# Altium schematic sheet lps_display_rev_g_p1.SchDoc
size B; Revision: F; SheetNumber: 1; SheetTotal: 2
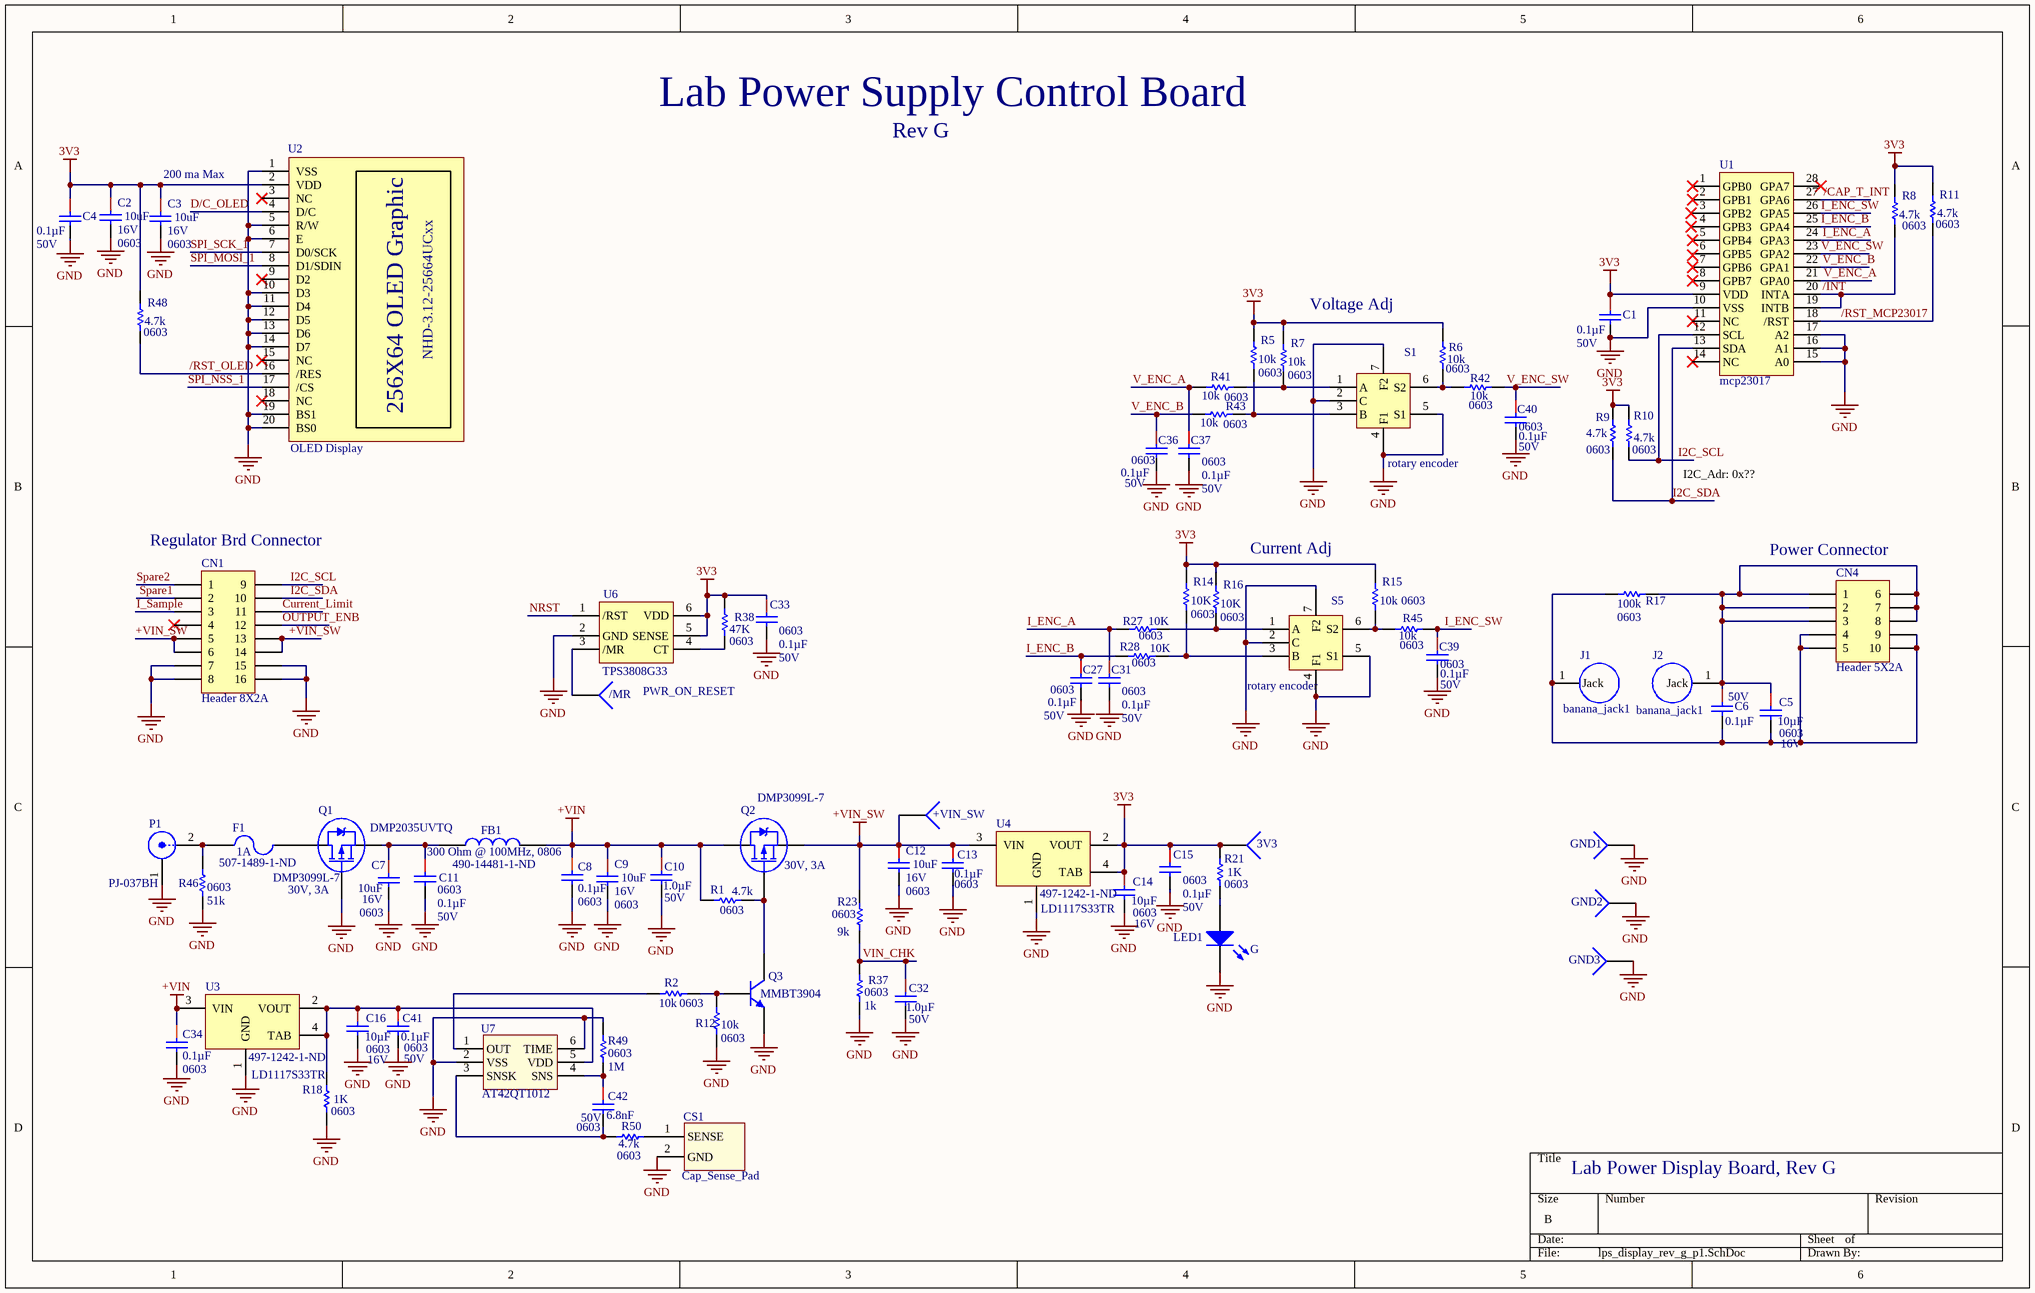
[diagram p0: lps_display_rev_g_p1.SchDoc]

## Parts
3V3  (no value)  [TestPoint-TH 35 mil]  (no BOM)
+VIN_SW  (no value)  [TestPoint-TH 35 mil]  (no BOM)
/MR  (no value)  [TestPoint-TH 35 mil]  (no BOM)
C1  Capacitance: 0.1µF  Voltage - Rated: 50V  [CAPC0603(1608)_N]  (hidden comment: 0.1uF 0603 50V)
C2  10uF  Package / Case: 0603  Voltage - Rated: 16V  [CAPC0603(1608)_N]
C3  10uF  Package / Case: 0603  Voltage - Rated: 16V  [CAPC0603(1608)_N]
C4  Capacitance: 0.1µF  Voltage - Rated: 50V  [CAPC0603(1608)_N]  (hidden comment: 0.1uF 0603 50V)
C5  Capacitance: 10µF  Package / Case: 0603  Voltage - Rated: 16V  [CAPC0603(1608)_N]  (hidden comment: 10uF)
C6  Capacitance: 0.1µF  Voltage - Rated: 50V  [CAPC0603(1608)_N]  (hidden comment: 0.1uF 0603 50V)
C7  10uF  Package / Case: 0603  Voltage - Rated: 16V  [CAPC0603(1608)_N]
C8  Capacitance: 0.1µF  Package / Case: 0603  [CAPC0603(1608)_N]  (hidden comment: 0.1uF)
C9  10uF  Package / Case: 0603  Voltage - Rated: 16V  [CAPC0603(1608)_N]
C10  Capacitance: 1.0µF  Voltage - Rated: 50V  [CAPC0603(1608)_N]  (hidden comment: 0.1uF 0603 50V)
C11  Package / Case: 0603  Capacitance: 0.1µF  Voltage - Rated: 50V  [CAPC0603(1608)_N]  (hidden comment: 0.1uF 0603 50V)
C12  10uF  Package / Case: 0603  Voltage - Rated: 16V  [CAPC0603(1608)_N]
C13  Package / Case: 0603  Capacitance: 0.1µF  [CAPC0603(1608)_N]  (hidden comment: 0.47uF)
C14  Capacitance: 10µF  Package / Case: 0603  Voltage - Rated: 16V  [CAPC0603(1608)_N]  (hidden comment: 10uF)
C15  Package / Case: 0603  Capacitance: 0.1µF  Voltage - Rated: 50V  [CAPC0603(1608)_N]  (hidden comment: 0.1uF 0603 50V)
C16  Capacitance: 10µF  Package / Case: 0603  Voltage - Rated: 16V  [CAPC0603(1608)_N]  (hidden comment: 10uF)
C27  Package / Case: 0603  Capacitance: 0.1µF  Voltage - Rated: 50V  [CAPC0603(1608)_N]  (hidden comment: 0.1uF 0603 50V)
C31  Package / Case: 0603  Capacitance: 0.1µF  Voltage - Rated: 50V  [CAPC0603(1608)_N]  (hidden comment: 0.1uF 0603 50V)
C32  Capacitance: 1.0µF  Voltage - Rated: 50V  [CAPC0603(1608)_N]  (hidden comment: 0.1uF 0603 50V)
C33  Package / Case: 0603  Capacitance: 0.1µF  Voltage - Rated: 50V  [CAPC0603(1608)_N]  (hidden comment: 0.1uF 0603 50V)
C34  Capacitance: 0.1µF  Package / Case: 0603  [CAPC0603(1608)_N]  (hidden comment: 0.1uF)
C36  Package / Case: 0603  Capacitance: 0.1µF  Voltage - Rated: 50V  [CAPC0603(1608)_N]  (hidden comment: 0.1uF 0603 50V)
C37  Package / Case: 0603  Capacitance: 0.1µF  Voltage - Rated: 50V  [CAPC0603(1608)_N]  (hidden comment: 0.1uF 0603 50V)
C39  Package / Case: 0603  Capacitance: 0.1µF  Voltage - Rated: 50V  [CAPC0603(1608)_N]  (hidden comment: 0.1uF 0603 50V)
C40  Package / Case: 0603  Capacitance: 0.1µF  Voltage - Rated: 50V  [CAPC0603(1608)_N]  (hidden comment: 0.1uF 0603 50V)
C41  Package / Case: 0603  Capacitance: 0.1µF  Voltage - Rated: 50V  [CAPC0603(1608)_N]  (hidden comment: 0.1uF 0603 50V)
C42  Package / Case: 0603  Capacitance: 6.8nF  Voltage - Rated: 50V  [CAPC0603(1608)_N]  (hidden comment: 0.1uF 0603 50V)
CN1  Header 8X2A  [HDR2X8_CEN]
CN4  Header 5X2A  [HDR2X5_CEN]
CS1  Cap_Sense_Pad  [CAP_TOUCH_ROUND]
F1  1A  [PTC-3225[1210]]
FB1  300 Ohm @ 100MHz, 0806  [RESC0805(2012)_M]
GND1  (no value)  [TestPoint-TH 35 mil]  (no BOM)
GND2  (no value)  [TestPoint-TH 35 mil]  (no BOM)
GND3  (no value)  [TestPoint-TH 35 mil]  (no BOM)
J1  banana_jack1  [Banana_jack1]
J2  banana_jack1  [Banana_jack1]
LED1  G  [SM-LED-0603]
P1  PJ-037BH  [pwrplug]
Q1  DMP3099L-7  Text: 30V, 3A  [SOT23]
Q2  DMP3099L-7  Text: 30V, 3A  [SOT23]
Q3  MMBT3904  [SOT23]
R1  Package / Case: 0603  [RESC0603(1608)_N]  (hidden comment: 4.7K)
R2  Resistance (Ohms): 10k  Package / Case: 0603  [RESC0603(1608)_N]  (hidden comment: 4.7K)
R5  Resistance (Ohms): 10k  Package / Case: 0603  [RESC0603(1608)_N]  (hidden comment: 4.7K)
R6  Resistance (Ohms): 10k  Package / Case: 0603  [RESC0603(1608)_N]  (hidden comment: 4.7K)
R7  Resistance (Ohms): 10k  Package / Case: 0603  [RESC0603(1608)_N]  (hidden comment: 4.7K)
R8  Package / Case: 0603  [RESC0603(1608)_N]  (hidden comment: 4.7K)
R9  Package / Case: 0603  [RESC0603(1608)_N]  (hidden comment: 4.7K)
R10  Package / Case: 0603  [RESC0603(1608)_N]  (hidden comment: 4.7K)
R11  Package / Case: 0603  [RESC0603(1608)_N]  (hidden comment: 4.7K)
R12  Resistance (Ohms): 10k  Package / Case: 0603  [RESC0603(1608)_N]  (hidden comment: 4.7K)
R14  Resistance (Ohms): 10K  Package / Case: 0603  [RESC0603(1608)_N]  (hidden comment: 4.7K)
R15  Resistance (Ohms): 10k  Package / Case: 0603  [RESC0603(1608)_N]  (hidden comment: 4.7K)
R16  Resistance (Ohms): 10K  Package / Case: 0603  [RESC0603(1608)_N]  (hidden comment: 4.7K)
R17  Resistance (Ohms): 100k  Package / Case: 0603  [RESC0603(1608)_N]  (hidden comment: 4.7K)
R18  Resistance (Ohms): 1K  Package / Case: 0603  [RESC0603(1608)_N]  (hidden comment: 4.7K)
R21  Resistance (Ohms): 1K  Package / Case: 0603  [RESC0603(1608)_N]  (hidden comment: 4.7K)
R23  Package / Case: 0603  Resistance (Ohms): 9k  [RESC0603(1608)_N]  (hidden comment: 1.0K)
R27  Resistance (Ohms): 10K  Package / Case: 0603  [RESC0603(1608)_N]  (hidden comment: 4.7K)
R28  Resistance (Ohms): 10K  Package / Case: 0603  [RESC0603(1608)_N]  (hidden comment: 4.7K)
R37  Package / Case: 0603  Resistance (Ohms): 1k  [RESC0603(1608)_N]  (hidden comment: 1.0K)
R38  Resistance (Ohms): 47K  Package / Case: 0603  [RESC0603(1608)_N]  (hidden comment: 4.7K)
R41  Resistance (Ohms): 10k  Package / Case: 0603  [RESC0603(1608)_N]  (hidden comment: 4.7K)
R42  Resistance (Ohms): 10k  Package / Case: 0603  [RESC0603(1608)_N]  (hidden comment: 4.7K)
R43  Resistance (Ohms): 10k  Package / Case: 0603  [RESC0603(1608)_N]  (hidden comment: 4.7K)
R45  Resistance (Ohms): 10k  Package / Case: 0603  [RESC0603(1608)_N]  (hidden comment: 4.7K)
R46  Package / Case: 0603  Resistance (Ohms): 51k  [RESC0603(1608)_N]  (hidden comment: 1.0K)
R48  Package / Case: 0603  [RESC0603(1608)_N]  (hidden comment: 4.7K)
R49  Package / Case: 0603  Resistance (Ohms): 1M  [RESC0603(1608)_N]  (hidden comment: 1.0K)
R50  Package / Case: 0603  Resistance (Ohms): 4.7k  [RESC0603(1608)_N]  (hidden comment: 1.0K)
S1  rotary encoder  [rotary encoder]
S5  rotary encoder  [rotary encoder]
U1  mcp23017  [SOIC28]
U2  OLED Display  [oled_graphic_256X64]
U3  Supplier Part Number 1: 497-1242-1-ND  [DSO-G3]  (hidden comment: 3.3V)
U4  Supplier Part Number 1: 497-1242-1-ND  [DSO-G3]  (hidden comment: 3.3V)
U6  TPS3808G33  [SOt-23-6]
U7  AT42QT1012  [SOt-23-6]

## Nets
3V3: 3V3.1 C1.1 C2.1 C3.1 C4.1 C14.1 C15.1 C33.1 R5.2 R6.2 R7.2 R8.2 R9.2 R10.2 R11.2 R14.2 R15.2 R16.2 R21.2 R38.2 R48.2 U1.9(VDD) U2.2(VDD) U4.2(VOUT) U4.4(TAB) U6.5(SENSE) U6.6(VDD)
+VIN: C8.1 C9.1 C10.1 C34.1 FB1.2 Q2.3(D) R1.2 U3.3(VIN)
+VIN_SW: +VIN_SW.1 C12.1 C13.1 CN1.5 CN1.6 CN1.13 CN1.14 Q2.2(S) R23.2 U4.3(VIN)
GND: C1.2 C2.2 C3.2 C4.2 C7.2 C8.2 C9.2 C10.2 C11.2 C12.2 C13.2 C14.2 C15.2 C16.2 C27.2 C31.2 C32.2 C33.2 C34.2 C36.2 C37.2 C39.2 C40.2 C41.2 CN1.7 CN1.8 CN1.15 CN1.16 CS1.2(GND) GND1.1 GND2.1 GND3.1 LED1.2 P1.1 Q1.1(G) Q3.2(E) R12.2 R18.1 R37.1 R46.1 R49.1 S1.2(C) S1.4(F1) S1.5(S1) S1.7(F2) S5.2(C) S5.4(F1) S5.5(S1) S5.7(F2) U1.10(VSS) U1.15(A0) U1.16(A1) U1.17(A2) U2.1(VSS) U2.5(R/W) U2.6(E) U2.10(D3) U2.11(D4) U2.12(D5) U2.13(D6) U2.14(D7) U2.19(BS1) U2.20(BS0) U3.1(GND) U4.1(GND) U6.2(GND) U7.2(VSS) U7.6(TIME)
/CAP_T_INT: U1.27(GPA6)
/INT: R8.1 U1.19(INTB) U1.20(INTA)
/RST_MCP23017: R11.1 U1.18(/RST)
/RST_OLED: R48.1 U2.16(/RES)
Current_Limit: CN1.11
D/C_OLED: U2.4(D/C)
I2C_SCL: CN1.9 R10.1 U1.12(SCL)
I2C_SDA: CN1.10 R9.1 U1.13(SDA)
I_ENC_A: C31.1 R27.2 U1.24(GPA3)
I_ENC_B: C27.1 R28.2 U1.25(GPA4)
I_ENC_SW: C39.1 R45.1 U1.26(GPA5)
I_Sample: CN1.3
NRST: U6.1(/RST)
OUTPUT_ENB: CN1.12
Spare1: CN1.2
Spare2: CN1.1
SPI_MOSI_1: U2.8(D1/SDIN)
SPI_NSS_1: U2.17(/CS)
SPI_SCK_1: U2.7(D0/SCK)
V_ENC_A: C37.1 R41.2 U1.21(GPA0)
V_ENC_B: C36.1 R43.2 U1.22(GPA1)
V_ENC_SW: C40.1 R42.1 U1.23(GPA2)
VIN_CHK: C32.1 R23.1 R37.2
Net/MR_1: /MR.1 U6.3(/MR)
NetC5_1: C5.1 C6.1 CN4.1 CN4.2 CN4.3 CN4.6 CN4.7 CN4.8 J2.1(Jack) R17.2
NetC5_2: C5.2 C6.2 CN4.4 CN4.5 CN4.9 CN4.10 J1.1(Jack) R17.1
NetC7_1: C7.1 C11.1 FB1.1 Q1.2(S)
NetC16_1: C16.1 C41.1 R18.2 U3.2(VOUT) U3.4(TAB) U7.5(VDD)
NetC42_1: C42.1 R49.2 U7.4(SNS)
NetC42_2: C42.2 R50.2 U7.3(SNSK)
NetCS1_1: CS1.1(SENSE) R50.1
NetF1_1: F1.1 P1.2 R46.2
NetF1_2: F1.2 Q1.3(D)
NetLED1_1: LED1.1 R21.1
NetQ2_1: Q2.1(G) Q3.3(C) R1.1
NetQ3_1: Q3.1(B) R2.1 R12.1
NetR2_2: R2.2 U7.1(OUT)
NetR5_1: R5.1 R43.1 S1.3(B)
NetR6_1: R6.1 R42.2 S1.6(S2)
NetR7_1: R7.1 R41.1 S1.1(A)
NetR14_1: R14.1 R28.1 S5.3(B)
NetR15_1: R15.1 R45.2 S5.6(S2)
NetR16_1: R16.1 R27.1 S5.1(A)
NetR38_1: R38.1 U6.4(CT)

Not connected (* = marked no-connect by the designer): CN1 4*; U1 1(GPB0)* 2(GPB1)* 3(GPB2) 4(GPB3) 5(GPB4)* 6(GPB5) 7(GPB6)* 8(GPB7)* 11(NC)* 14(NC)* 28(GPA7)*; U2 3(NC)* 9(D2)* 15(NC)* 18(NC)*

## Notes on the sheet
- Lab Power Supply Control Board
- Rev G
- (near C3) 200 ma Max
- Voltage Adj
- I2C_Adr: 0x??
- (near CN1) Regulator Brd Connector
- Current Adj
- (near CN4) Power Connector
- PWR_ON_RESET
- (near Q1) DMP2035UVTQ
- 507-1489-1-ND
- (near FB1) 490-14481-1-ND
- LD1117S33TR
- (near R18) LD1117S33TR
- Lab Power Display Board, Rev G
- (in symbol OLED Display) NHD-3.12-25664UCxx; 256X64 OLED Graphic

## Library data of the parts
3V3 +VIN_SW /MR GND1-GND3 = TestPoint: Test Point
C1 C4 C6 C10 C32 = CAP CER 0.1UF 50V 10% X7R 0603: Manufacturer: Kemet; Manufacturer Part Number: C0603C104K5RACTU; Tolerance: ±10%; Temperature Coefficient: X7R; ClassName: AD1; Supplier 1: Digi-Key; RoHS: RoHS Compliant; Category: Capacitors; Stock 1: 1397942; Pricing 1: 1=0.1, 10=0.041, 50=0.0222, 100=0.0187, 250=0.01532, 500=0.0131, 1000=0.0102 (USD); Packaging: Cut Tape (CT); Mounting Type: Surface Mount, MLCC; Operating Temperature: -55°C ~ 125°C; Applications: General Purpose; Ratings: -; Package / Case: 0603 (1608 Metric); Size / Dimension: 0.063" L x 0.031" W (1.60mm x 0.80mm); Height - Seated (Max): -; Thickness (Max): 0.034" (0.87mm); Lead Spacing: -; Features: -; Lead Style: -; ComponentLink1URL: http://www.kemet.com/docfinder?Partnumber=C0603C104K5RACTU; ComponentLink1Description: http://www.kemet.com/docfinder?Partnumber=C0603C104K5RACTU; Supplier Part Number 1: 399-5089-1-ND
C2 C3 C7 C9 C12 = CAP CER 10UF 16V 20% X5R 0603: 10UF 0603 16V; Manufacturer: Murata Electronics North America; Manufacturer Part Number: GRM188R61C106MA73D; Capacitance: 10µF; Tolerance: ±20%; Temperature Coefficient: X5R; Supplier 1: Digi-Key; RoHS: RoHS Compliant; Category: Capacitors; Stock 1: 99081; Pricing 1: 1=0.18, 10=0.167, 25=0.1428, 50=0.1214, 100=0.1167, 250=0.1048, 500=0.10002, 1000=0.08335 (USD); Packaging: Cut Tape (CT); Mounting Type: Surface Mount, MLCC; Operating Temperature: -55°C ~ 85°C; Applications: General Purpose; Ratings: -; Size / Dimension: 0.063" L x 0.031" W (1.60mm x 0.80mm); Height - Seated (Max): -; Thickness (Max): 0.031" (0.80mm); Lead Spacing: -; Features: -; Lead Style: -; ComponentLink1URL: http://www.murata.com/~/media/webrenewal/support/library/catalog/products/capacitor/mlcc/c02e.ashx; ComponentLink1Description: http://www.murata.com/~/media/webrenewal/support/library/catalog/products/capacitor/mlcc/c02e.ashx; Supplier Part Number 1: 490-7201-1-ND
C5 C14 C16 = CAP CER 10UF 16V 20% X5R 0603: 10UF 0603 16V; Manufacturer: Murata Electronics North America; Manufacturer Part Number: GRM188R61C106MA73D; Tolerance: ±20%; Temperature Coefficient: X5R; Supplier 1: Digi-Key; RoHS: RoHS Compliant; Category: Capacitors; Stock 1: 99081; Pricing 1: 1=0.18, 10=0.167, 25=0.1428, 50=0.1214, 100=0.1167, 250=0.1048, 500=0.10002, 1000=0.08335 (USD); Packaging: Cut Tape (CT); Mounting Type: Surface Mount, MLCC; Operating Temperature: -55°C ~ 85°C; Applications: General Purpose; Ratings: -; Size / Dimension: 0.063" L x 0.031" W (1.60mm x 0.80mm); Height - Seated (Max): -; Thickness (Max): 0.031" (0.80mm); Lead Spacing: -; Features: -; Lead Style: -; ComponentLink1URL: http://www.murata.com/~/media/webrenewal/support/library/catalog/products/capacitor/mlcc/c02e.ashx; ComponentLink1Description: http://www.murata.com/~/media/webrenewal/support/library/catalog/products/capacitor/mlcc/c02e.ashx; Supplier Part Number 1: 490-7201-1-ND
C8 C34 = CAP CER 0.1UF 16V 10% X7R 0603: 0.1uF 0603 16V; Manufacturer: Kemet; Manufacturer Part Number: C0603C104K4RACTU; Tolerance: ±10%; Temperature Coefficient: X7R; Supplier 1: Digi-Key; RoHS: RoHS Compliant; Category: Capacitors; Stock 1: 2360000; Pricing 1: 4000=0.00414, 8000=0.00378, 12000=0.0036, 28000=0.00342, 100000=0.00248 (USD); Packaging: Tape & Reel (TR); Mounting Type: Surface Mount, MLCC; Operating Temperature: -55°C ~ 125°C; Applications: General Purpose; Ratings: -; Size / Dimension: 0.063" L x 0.031" W (1.60mm x 0.80mm); Height - Seated (Max): -; Thickness (Max): 0.034" (0.87mm); Lead Spacing: -; Features: -; Lead Style: -; ComponentLink1URL: http://www.kemet.com/datasheets&C0603C104K4RACTU; ComponentLink1Description: http://www.kemet.com/datasheets&C0603C104K4RACTU; Supplier Part Number 1: 399-1096-2-ND; Voltage - Rated: 16V
C11 C15 C27 C31 C33 C36 C37 C39-C42 = CAP CER 0.1UF 50V 10% X7R 0603: Manufacturer: Yageo; Manufacturer Part Number: CC0603ZRY5V9BB104; Tolerance: -20%, +80%; Temperature Coefficient: Y5V (F); ClassName: *; Supplier 1: Digi-Key; RoHS: RoHS Compliant; Category: Capacitors; Stock 1: 2192156; Pricing 1: 1=0.1, 10=0.019, 100=0.0087, 500=0.0062, 1000=0.00487 (USD); Packaging: Cut Tape (CT); Part Status: Active; Operating Temperature: -30°C ~ 85°C; Features: -; Ratings: -; Applications: General Purpose; Failure Rate: -; Mounting Type: Surface Mount, MLCC; Size / Dimension: 0.063" L x 0.031" W (1.60mm x 0.80mm); Height - Seated (Max): -; Thickness (Max): 0.035" (0.90mm); Lead Spacing: -; Lead Style: -; ComponentLink1URL: http://www.yageo.com/documents/recent/UPY-GPHC_Y5V_6.3V-to-50V_8.pdf; ComponentLink1Description: http://www.yageo.com/documents/recent/UPY-GPHC_Y5V_6.3V-to-50V_8.pdf; Supplier Part Number 1: 311-1343-1-ND
C13 = CAP CER 0.47UF 16V 10% X7R 0603: 0.47uF 0603 16V; Manufacturer: Kemet; Manufacturer Part Number: C0603C474K4RACTU; Tolerance: ±10%; Temperature Coefficient: X7R; Supplier 1: Digi-Key; RoHS: RoHS Compliant; Category: Capacitors; Stock 1: 84679; Pricing 1: 1=0.15, 10=0.1, 50=0.0576, 100=0.0475, 250=0.04, 500=0.0335, 1000=0.0275 (USD); Packaging: Cut Tape (CT); Voltage - Rated: 16V; Mounting Type: Surface Mount, MLCC; Operating Temperature: -55°C ~ 125°C; Applications: General Purpose; Ratings: -; Size / Dimension: 0.063" L x 0.031" W (1.60mm x 0.80mm); Height - Seated (Max): -; Thickness (Max): 0.034" (0.87mm); Lead Spacing: -; Features: -; Lead Style: -; ComponentLink1URL: http://www.kemet.com/docfinder?Partnumber=C0603C474K4RACTU; ComponentLink1Description: http://www.kemet.com/docfinder?Partnumber=C0603C474K4RACTU; Supplier Part Number 1: 399-4922-1-ND
CN1 = CMP-001-0325-01: Header, 8-Pin, Dual row; Signal Integrity: Connector; Publisher: Altium Limited; Designator: Header 8X2A; LatestRevisionNote: Re-released for DXP Platform.; Pin Count: 16; Component Name: Header 8X2A; LatestRevisionDate: 17-Jul-2002
CN4 = CMP-001-0310-01: Header, 5-Pin, Dual row; Signal Integrity: Connector; Designator: Header 5X2A; Component Name: Header 5X2A; LatestRevisionDate: 17-Jul-2002; LatestRevisionNote: Re-released for DXP Platform.; Pin Count: 10; Publisher: Altium Limited
F1 = 0ZCB0050FF2G: 1A PTC Fuse; Manufacturer: Bel Fuse; Vendor: Digikey; PN: 507-1489-1-ND; MPN: 0ZCB0050FF2G
FB1 = FERRITE 40 OHM 1.5A 0805: 40 OHM 0805 1.5A; Manufacturer: Laird-Signal Integrity Products; Manufacturer Part Number: MI0805K400R-10; DC Resistance (DCR): 50 mOhm Max; Filter Type: Differential Mode - Single; Impedance @ Frequency: 40 Ohm @ 100MHz; Creator: osman; Supplier 1: Digi-Key; RoHS: RoHS Compliant; Category: Filters; Stock 1: 112318; Pricing 1: 1=0.1, 10=0.077, 25=0.07, 50=0.0628, 100=0.0461, 250=0.03352, 500=0.03074, 1000=0.02654 (USD); Packaging: Cut Tape (CT); Current Rating: 1.5A; Package / Case: 0805 (2012 Metric); Mounting Type: Surface Mount; Height (Max): 0.043" (1.10mm); Size / Dimension: 0.079" L x 0.049" W (2.00mm x 1.25mm); ComponentLink1URL: http://staging.lairdtech.com/WorkArea/linkit.aspx?LinkIdentifier=id&ItemID=4949; ComponentLink1Description: http://staging.lairdtech.com/WorkArea/linkit.aspx?LinkIdentifier=id&ItemID=4949; Supplier Part Number 1: 240-2389-1-ND
LED1 = 0603 LED: 0603 SMD LED; PN: P11500CT-ND; Vendor: Digikey
P1 = PJ-037BH: 2.5x5.5mm Power Jack; Manufacturer: CUI Inc; Gender: Male; Plug/Mating Plug Diameter: 2.5mm ID, 5.5mm OD; Number of Positions/Contacts: 2 Conductors, 2 Contacts; Internal Switch(s): Does Not Contain Switch; Shielding: Unshielded; Voltage - Rated: 16VDC; Current Rating: 5A; Supplier 1: Digi-Key; Manufacturer Part Number: PJ-037BH; RoHS: RoHS Compliant; Category: Connectors, Interconnects; Stock 1: 179; Pricing 1: 1=1.11, 10=0.777, 100=0.5217, 500=0.4218, 1000=0.3774, 2500=0.2997 (USD); Connector Type: Jack; Mounting Type: Through Hole, Right Angle; Termination: Solder Eyelet(s); Features: -; Color: Black; Contact Material: Copper; Contact Material - Plating: Nickel; Housing Color: Black; Housing Material: Thermoplastic; Operating Temperature: -; ComponentLink1URL: http://www.cui.com/product/resource/digikeypdf/pj-037bh.pdf; ComponentLink1Description: http://www.cui.com/product/resource/digikeypdf/pj-037bh.pdf; Supplier Part Number 1: CP-037BH-ND
Q1 Q2 = DMP3099L-7: MOSFET P-CH 30V SOT23; Manufacturer: Diodes Incorporated; FET Type: P-Channel; Current - Continuous Drain (Id) @ 25°C: 3.8A (Ta); Drive Voltage (Max Rds On,  Min Rds On): 4.5V, 10V; Vgs(th) (Max) @ Id: 2.1V @ 250µA; Vgs (Max): ±20V; Power Dissipation (Max): 1.08W (Ta); Rds On (Max) @ Id, Vgs: 65 mOhm @ 3.8A, 10V; Supplier 1: Digi-Key; Manufacturer Part Number: DMP3099L-7; RoHS: RoHS Compliant; Category: Discrete Semiconductor Products; Stock 1: 138833; Pricing 1: 1=0.42, 10=0.306, 100=0.1801, 500=0.10198, 1000=0.07818 (USD); Packaging: Cut Tape (CT); Part Status: Active; Technology: MOSFET (Metal Oxide); FET Feature: -; Operating Temperature: -55°C ~ 150°C (TJ); Mounting Type: Surface Mount; Supplier Device Package: SOT-23; Package / Case: TO-236-3, SC-59, SOT-23-3; ComponentLink1URL: https://www.diodes.com/assets/Datasheets/DMP3099L.pdf; ComponentLink1Description: https://www.diodes.com/assets/Datasheets/DMP3099L.pdf; Supplier Part Number 1: DMP3099L-7DICT-ND
Q3 = MMBT3904: NPN General Purpose Amplifier; Manufacturer: ON Semiconductor; MPN: MMBT3904WT1G; Vendor: Digikey; PN: MMBT3904WT1GOSCT-ND; Current - Collector (Ic) (Max): 200mA; Voltage - Collector Emitter Breakdown (Max): 40V; Vce Saturation (Max) @ Ib, Ic: 300mV @ 5mA, 50mA; DC Current Gain (hFE) (Min) @ Ic, Vce: 100 @ 10mA, 1V; Power - Max: 150mW; Frequency - Transition: 300MHz; Supplier 1: Digi-Key; Manufacturer Part Number: MMBT3904WT1G; RoHS: RoHS Compliant; Category: Discrete Semiconductor Products; Stock 1: 3; Pricing 1: 1=0.17, 10=0.154, 25=0.1404, 100=0.101, 250=0.05952, 500=0.04938, 1000=0.03368 (USD); Packaging: Cut Tape (CT); Transistor Type: NPN; Current - Collector Cutoff (Max): -; Mounting Type: Surface Mount; Package / Case: SC-70, SOT-323; Supplier Device Package: SC-70-3 (SOT323); ComponentLink1URL: http://www.onsemi.com/pub_link/Collateral/MMBT3904WT1-D.PDF; ComponentLink1Description: http://www.onsemi.com/pub_link/Collateral/MMBT3904WT1-D.PDF; Supplier Part Number 1: MMBT3904WT1GOSCT-ND
R1 R2 R5-R12 R14-R18 R21 R27 R28 R38 R41-R43 R45 R48 = RES 4.7K OHM 1/10W 5% 0603 SMD: 4.7K 0603; Manufacturer: Panasonic Electronic Components; Manufacturer Part Number: ERJ-3GEYJ472V; Tolerance: ±5%; Power (Watts): 0.1W, 1/10W; Temperature Coefficient: ±200ppm/°C; Supplier 1: Digi-Key; RoHS: RoHS Compliant; Category: Resistors; Stock 1: 1261582; Pricing 1: 1=0.1, 50=0.0126, 100=0.0096, 250=0.00716, 500=0.00528, 1000=0.00352, 2500=0.00297 (USD); Packaging: Cut Tape (CT); Composition: Thick Film; Features: Automotive AEC-Q200 Qualified; Supplier Device Package: 0603; Size / Dimension: 0.063" L x 0.031" W (1.60mm x 0.80mm); Height: 0.022" (0.55mm); Number of Terminations: 2; ComponentLink1URL: http://industrial.panasonic.com/www-cgi/jvcr13pz.cgi?E+PZ+3+AOA0001+ERJ3GEYJ472V+7+WW; ComponentLink1Description: http://industrial.panasonic.com/www-cgi/jvcr13pz.cgi?E+PZ+3+AOA0001+ERJ3GEYJ472V+7+WW; Supplier Part Number 1: P4.7KGCT-ND
  R1 R8-R11 R48: Resistance (Ohms): 4.7k
R23 R37 R46 R49 R50 = RES 1K OHM 1% 1/10W 0603: 1.0K 0603; Manufacturer: Stackpole Electronics Inc.; Manufacturer Part Number: RMCF0603FT1K00; Tolerance: ±1%; Power (Watts): 0.1W, 1/10W; Temperature Coefficient: ±100ppm/°C; Supplier 1: Digi-Key; RoHS: RoHS Compliant; Category: Resistors; Stock 1: 411308; Pricing 1: 1=0.1, 10=0.02, 100=0.0081, 1000=0.00364, 2500=0.00316 (USD); Packaging: Cut Tape (CT); Part Status: Active; Composition: Thick Film; Features: Automotive AEC-Q200; Operating Temperature: -55°C ~ 155°C; Size / Dimension: 0.061" L x 0.031" W (1.55mm x 0.80mm); Height - Seated (Max): 0.022" (0.55mm); Failure Rate: -; ComponentLink1URL: https://www.seielect.com/Catalog/SEI-RMCF_RMCP.pdf; ComponentLink1Description: https://www.seielect.com/Catalog/SEI-RMCF_RMCP.pdf; Supplier Part Number 1: RMCF0603FT1K00CT-ND; Supplier Device Package: 0603
U1 = mcp23017: I2C 16 bit Expander
U3 U4 = LD1117S33: 3.3 volt fixed regulator, 800mA; Supplier 1: Digi-Key
U7 = AT42QT1012: CAP QTouch Chip